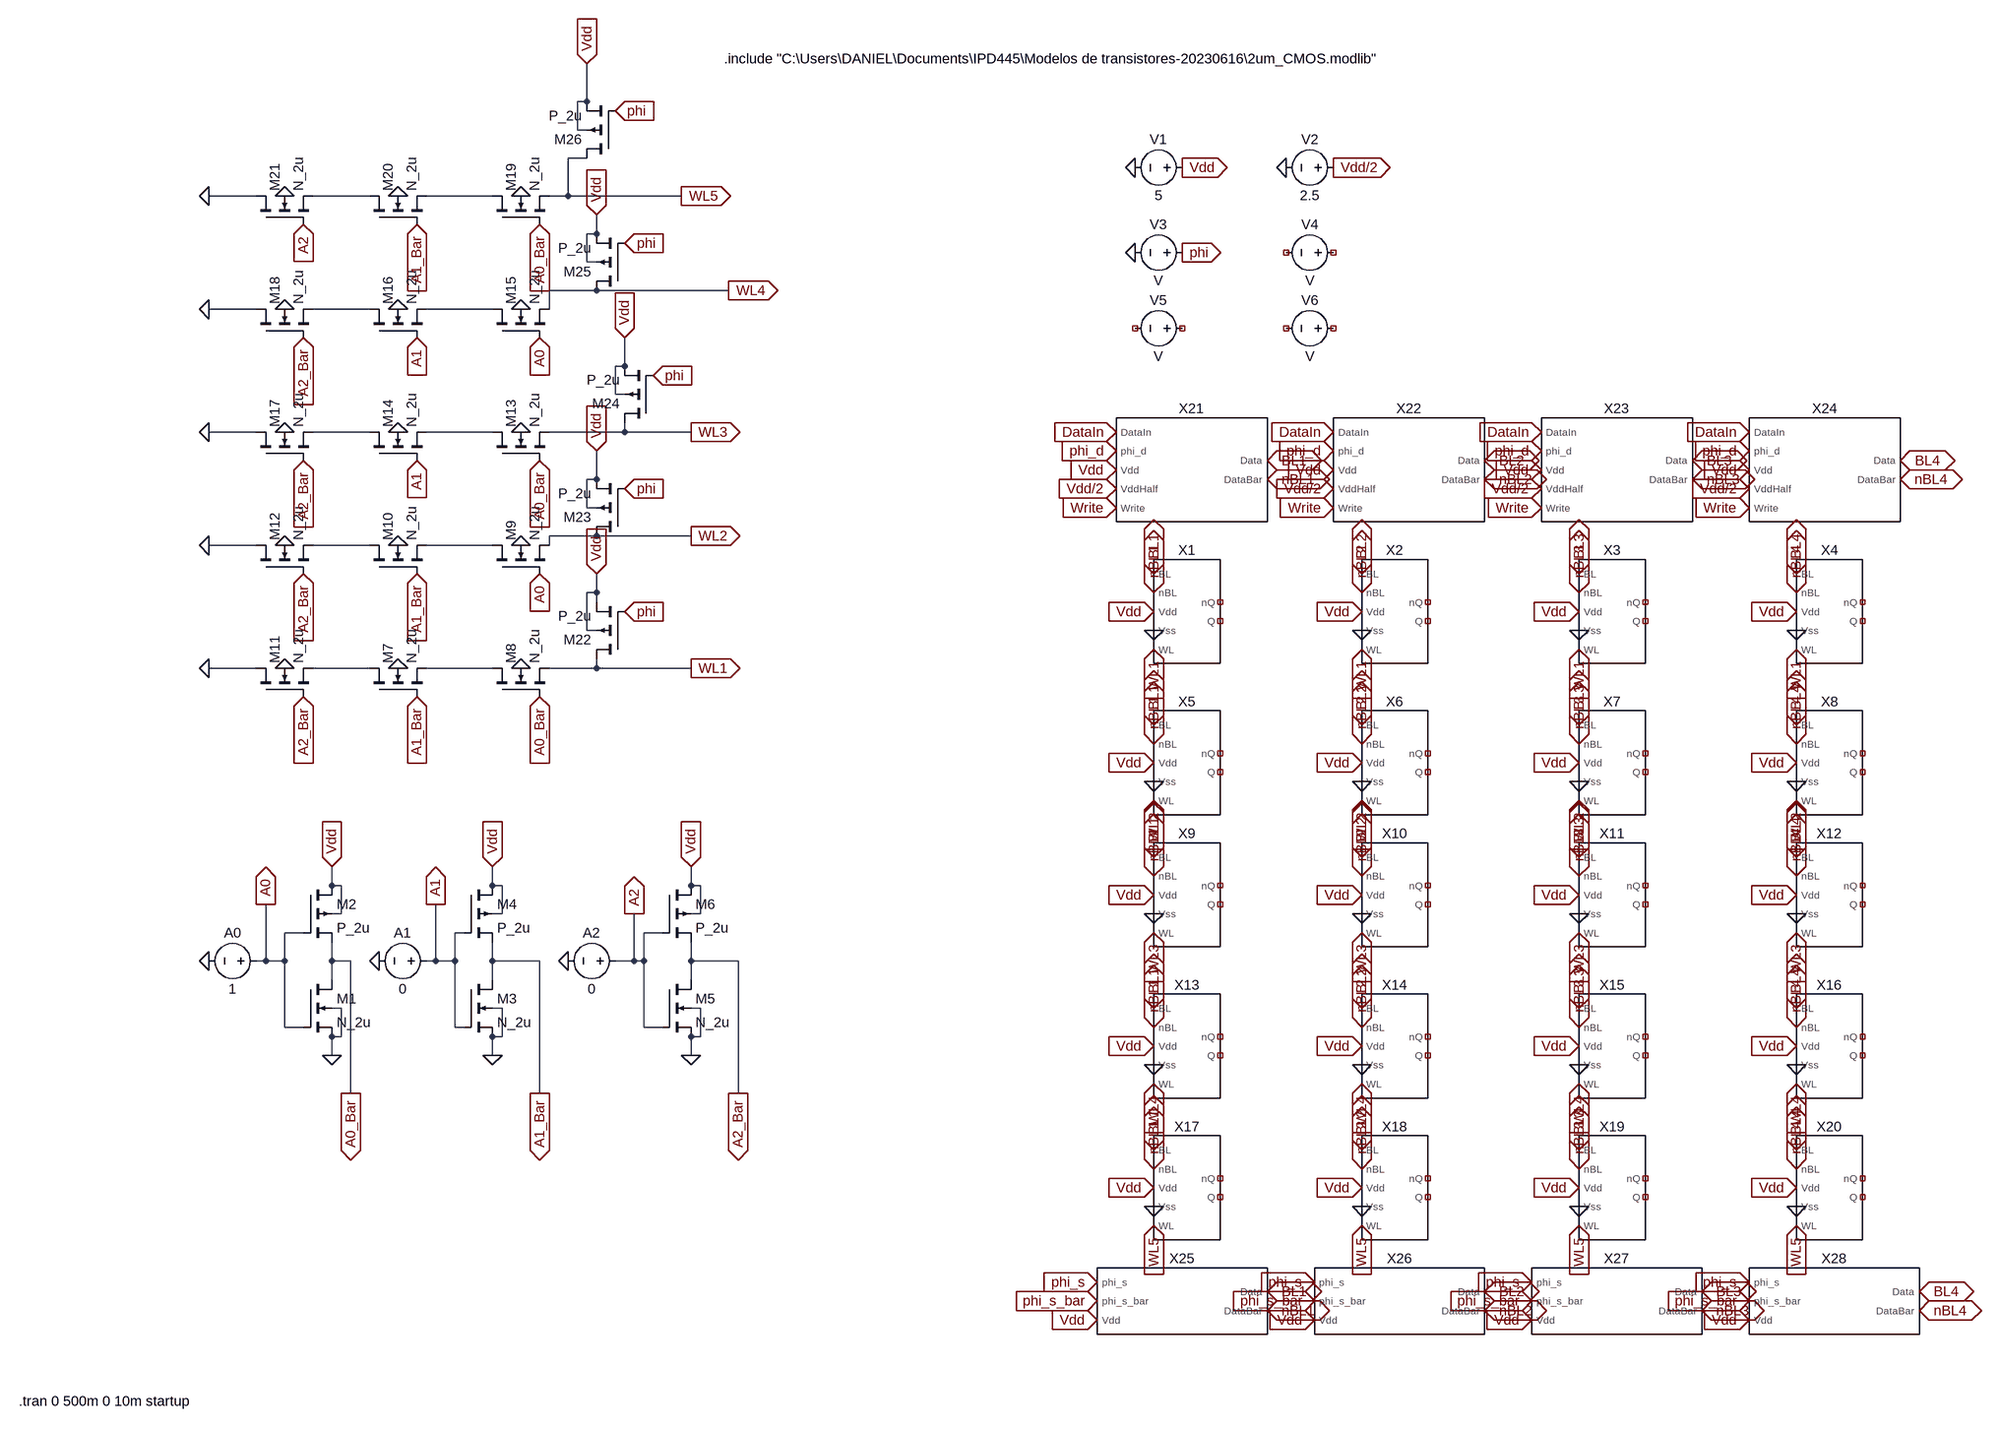
[diagram p0: schematic completo.asc]
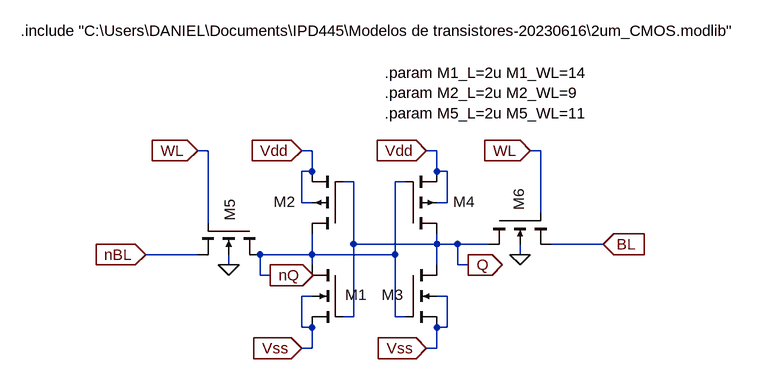
[diagram p1: sub-circuit core-final.asc]
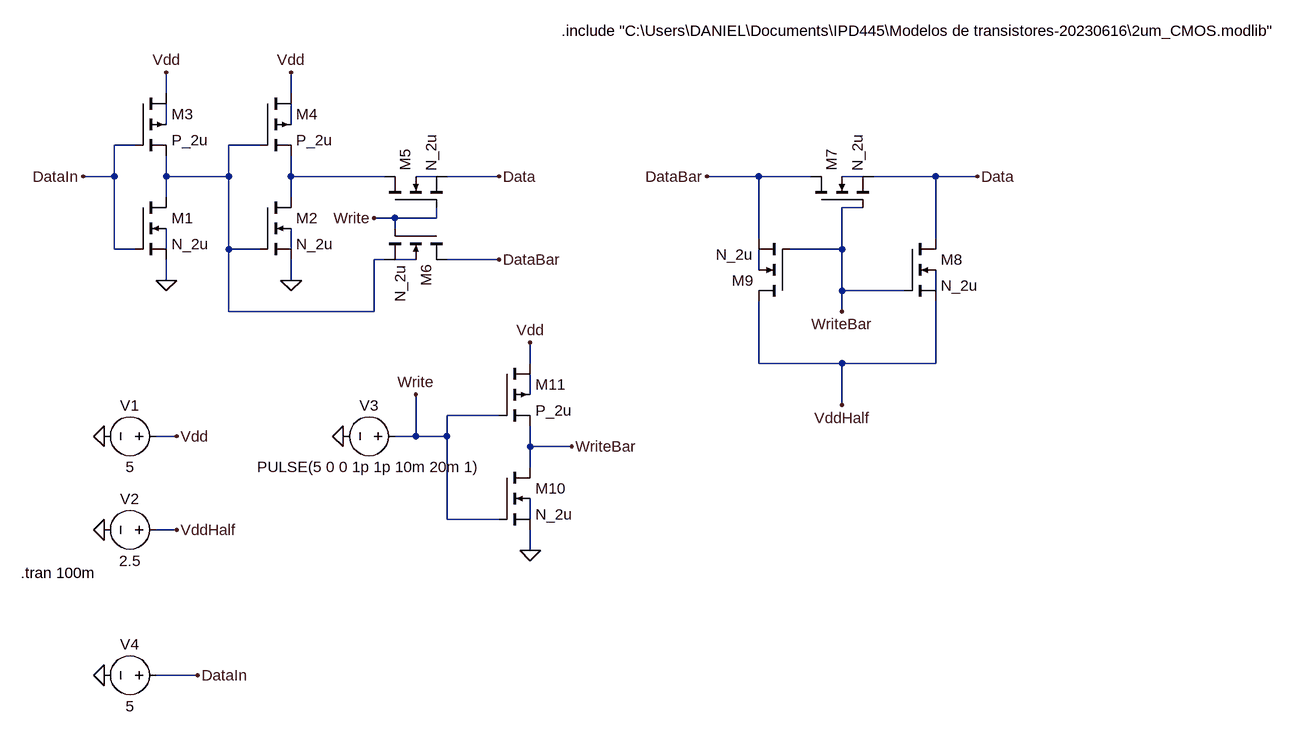
[diagram p2: sub-circuit drivers.asc]
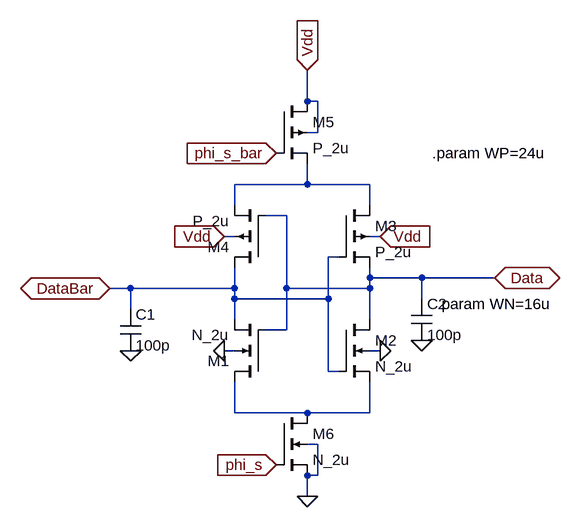
[diagram p3: sub-circuit amp.asc]
completo.asc, the LTspice schematic file:
Version 4
SHEET 1 1400 1464
WIRE -976 -832 -976 -896
WIRE -976 -832 -992 -832
WIRE -992 -784 -992 -832
WIRE -976 -784 -992 -784
WIRE -976 -736 -1008 -736
WIRE -1536 -672 -1616 -672
WIRE -1344 -672 -1440 -672
WIRE -1136 -672 -1248 -672
WIRE -1008 -672 -1008 -736
WIRE -1008 -672 -1040 -672
WIRE -816 -672 -1008 -672
WIRE -960 -608 -960 -640
WIRE -960 -608 -976 -608
WIRE -976 -560 -976 -608
WIRE -960 -560 -976 -560
WIRE -960 -512 -1040 -512
WIRE -736 -512 -960 -512
WIRE -1536 -480 -1616 -480
WIRE -1344 -480 -1440 -480
WIRE -1136 -480 -1248 -480
WIRE -1040 -480 -1040 -512
WIRE -912 -384 -912 -432
WIRE -912 -384 -928 -384
WIRE -928 -336 -928 -384
WIRE -912 -336 -928 -336
WIRE -1536 -272 -1616 -272
WIRE -1344 -272 -1440 -272
WIRE -1136 -272 -1248 -272
WIRE -912 -272 -912 -288
WIRE -912 -272 -1040 -272
WIRE -800 -272 -912 -272
WIRE -960 -192 -960 -240
WIRE -960 -192 -976 -192
WIRE -976 -144 -976 -192
WIRE -960 -144 -976 -144
WIRE -960 -96 -1040 -96
WIRE -800 -96 -960 -96
WIRE -1536 -80 -1616 -80
WIRE -1344 -80 -1440 -80
WIRE -1136 -80 -1248 -80
WIRE -1040 -80 -1040 -96
WIRE -960 0 -960 -32
WIRE -960 0 -976 0
WIRE -960 16 -960 0
WIRE -976 64 -976 0
WIRE -960 64 -976 64
WIRE -1536 128 -1616 128
WIRE -1344 128 -1440 128
WIRE -1136 128 -1248 128
WIRE -960 128 -960 112
WIRE -960 128 -1040 128
WIRE -800 128 -960 128
WIRE -1408 496 -1408 464
WIRE -1392 496 -1408 496
WIRE -1136 496 -1136 464
WIRE -1120 496 -1136 496
WIRE -800 496 -800 464
WIRE -784 496 -800 496
WIRE -1392 544 -1392 496
WIRE -1392 544 -1408 544
WIRE -1120 544 -1120 496
WIRE -1120 544 -1136 544
WIRE -784 544 -784 496
WIRE -784 544 -800 544
WIRE -1456 576 -1488 576
WIRE -1184 576 -1200 576
WIRE -848 576 -880 576
WIRE -1520 624 -1520 528
WIRE -1520 624 -1536 624
WIRE -1488 624 -1488 576
WIRE -1488 624 -1520 624
WIRE -1408 624 -1408 592
WIRE -1376 624 -1408 624
WIRE -1232 624 -1232 528
WIRE -1232 624 -1248 624
WIRE -1200 624 -1200 576
WIRE -1200 624 -1232 624
WIRE -1136 624 -1136 592
WIRE -1056 624 -1136 624
WIRE -896 624 -896 544
WIRE -896 624 -928 624
WIRE -880 624 -880 576
WIRE -880 624 -896 624
WIRE -800 624 -800 592
WIRE -720 624 -800 624
WIRE -1408 656 -1408 624
WIRE -1136 656 -1136 624
WIRE -800 656 -800 624
WIRE -1392 704 -1408 704
WIRE -1120 704 -1136 704
WIRE -784 704 -800 704
WIRE -1488 736 -1488 624
WIRE -1456 736 -1488 736
WIRE -1200 736 -1200 624
WIRE -1184 736 -1200 736
WIRE -880 736 -880 624
WIRE -848 736 -880 736
WIRE -1392 752 -1392 704
WIRE -1392 752 -1408 752
WIRE -1120 752 -1120 704
WIRE -1120 752 -1136 752
WIRE -784 752 -784 704
WIRE -784 752 -800 752
WIRE -1408 784 -1408 752
WIRE -1136 784 -1136 752
WIRE -800 784 -800 752
WIRE -1376 848 -1376 624
WIRE -1056 848 -1056 624
WIRE -720 848 -720 624
FLAG -16 96 WL1
IOPIN -16 96 In
FLAG 336 96 WL1
IOPIN 336 96 In
FLAG 704 96 WL1
IOPIN 704 96 In
FLAG 1072 96 WL1
IOPIN 1072 96 In
FLAG -16 352 WL2
IOPIN -16 352 In
FLAG 336 352 WL2
IOPIN 336 352 In
FLAG 704 352 WL2
IOPIN 704 352 In
FLAG 1072 352 WL2
IOPIN 1072 352 In
FLAG -16 576 WL3
IOPIN -16 576 In
FLAG 336 576 WL3
IOPIN 336 576 In
FLAG 704 576 WL3
IOPIN 704 576 In
FLAG 1072 576 WL3
IOPIN 1072 576 In
FLAG -16 832 WL4
IOPIN -16 832 In
FLAG 336 832 WL4
IOPIN 336 832 In
FLAG 704 832 WL4
IOPIN 704 832 In
FLAG 1072 832 WL4
IOPIN 1072 832 In
FLAG -16 1072 WL5
IOPIN -16 1072 In
FLAG 336 1072 WL5
IOPIN 336 1072 In
FLAG 704 1072 WL5
IOPIN 704 1072 In
FLAG 1072 1072 WL5
IOPIN 1072 1072 In
FLAG -16 -32 BL1
IOPIN -16 -32 BiDir
FLAG -16 224 BL1
IOPIN -16 224 BiDir
FLAG -16 448 BL1
IOPIN -16 448 BiDir
FLAG -16 704 BL1
IOPIN -16 704 BiDir
FLAG -16 944 BL1
IOPIN -16 944 BiDir
FLAG 336 -32 BL2
IOPIN 336 -32 BiDir
FLAG 336 224 BL2
IOPIN 336 224 BiDir
FLAG 336 448 BL2
IOPIN 336 448 BiDir
FLAG 336 704 BL2
IOPIN 336 704 BiDir
FLAG 336 944 BL2
IOPIN 336 944 BiDir
FLAG 704 -32 BL3
IOPIN 704 -32 BiDir
FLAG 704 224 BL3
IOPIN 704 224 BiDir
FLAG 704 448 BL3
IOPIN 704 448 BiDir
FLAG 704 704 BL3
IOPIN 704 704 BiDir
FLAG 704 944 BL3
IOPIN 704 944 BiDir
FLAG 1072 -32 BL4
IOPIN 1072 -32 BiDir
FLAG 1072 224 BL4
IOPIN 1072 224 BiDir
FLAG 1072 448 BL4
IOPIN 1072 448 BiDir
FLAG 1072 704 BL4
IOPIN 1072 704 BiDir
FLAG 1072 944 BL4
IOPIN 1072 944 BiDir
FLAG 896 -224 BL3
IOPIN 896 -224 BiDir
FLAG 1248 -224 BL4
IOPIN 1248 -224 BiDir
FLAG 544 -224 BL2
IOPIN 544 -224 BiDir
FLAG 176 -224 BL1
IOPIN 176 -224 BiDir
FLAG 176 1184 BL1
IOPIN 176 1184 BiDir
FLAG 544 1184 BL2
IOPIN 544 1184 BiDir
FLAG 912 1184 BL3
IOPIN 912 1184 BiDir
FLAG 1280 1184 BL4
IOPIN 1280 1184 BiDir
FLAG -112 1232 Vdd
IOPIN -112 1232 In
FLAG 256 1232 Vdd
IOPIN 256 1232 In
FLAG 624 1232 Vdd
IOPIN 624 1232 In
FLAG 992 1232 Vdd
IOPIN 992 1232 In
FLAG -80 -208 Vdd
IOPIN -80 -208 In
FLAG 288 -208 Vdd
IOPIN 288 -208 In
FLAG 640 -208 Vdd
IOPIN 640 -208 In
FLAG 992 -208 Vdd
IOPIN 992 -208 In
FLAG 176 -192 nBL1
IOPIN 176 -192 BiDir
FLAG -16 0 nBL1
IOPIN -16 0 BiDir
FLAG -16 256 nBL1
IOPIN -16 256 BiDir
FLAG -16 480 nBL1
IOPIN -16 480 BiDir
FLAG -16 736 nBL1
IOPIN -16 736 BiDir
FLAG -16 976 nBL1
IOPIN -16 976 BiDir
FLAG 544 -192 nBL2
IOPIN 544 -192 BiDir
FLAG 336 0 nBL2
IOPIN 336 0 BiDir
FLAG 336 256 nBL2
IOPIN 336 256 BiDir
FLAG 336 480 nBL2
IOPIN 336 480 BiDir
FLAG 336 736 nBL2
IOPIN 336 736 BiDir
FLAG 336 976 nBL2
IOPIN 336 976 BiDir
FLAG 544 1216 nBL2
IOPIN 544 1216 BiDir
FLAG 176 1216 nBL1
IOPIN 176 1216 BiDir
FLAG 896 -192 nBL3
IOPIN 896 -192 BiDir
FLAG 704 0 nBL3
IOPIN 704 0 BiDir
FLAG 704 256 nBL3
IOPIN 704 256 BiDir
FLAG 704 480 nBL3
IOPIN 704 480 BiDir
FLAG 704 736 nBL3
IOPIN 704 736 BiDir
FLAG 704 976 nBL3
IOPIN 704 976 BiDir
FLAG 912 1216 nBL3
IOPIN 912 1216 BiDir
FLAG 1248 -192 nBL4
IOPIN 1248 -192 BiDir
FLAG 1072 0 nBL4
IOPIN 1072 0 BiDir
FLAG 1072 256 nBL4
IOPIN 1072 256 BiDir
FLAG 1072 480 nBL4
IOPIN 1072 480 BiDir
FLAG 1072 736 nBL4
IOPIN 1072 736 BiDir
FLAG 1072 976 nBL4
IOPIN 1072 976 BiDir
FLAG 1280 1216 nBL4
IOPIN 1280 1216 BiDir
FLAG -16 1008 Vdd
IOPIN -16 1008 In
FLAG -16 768 Vdd
IOPIN -16 768 In
FLAG -16 512 Vdd
IOPIN -16 512 In
FLAG -16 288 Vdd
IOPIN -16 288 In
FLAG -16 32 Vdd
IOPIN -16 32 In
FLAG 336 32 Vdd
IOPIN 336 32 In
FLAG 704 32 Vdd
IOPIN 704 32 In
FLAG 1072 32 Vdd
IOPIN 1072 32 In
FLAG 1072 288 Vdd
IOPIN 1072 288 In
FLAG 1072 512 Vdd
IOPIN 1072 512 In
FLAG 1072 768 Vdd
IOPIN 1072 768 In
FLAG 1072 1008 Vdd
IOPIN 1072 1008 In
FLAG 704 1008 Vdd
IOPIN 704 1008 In
FLAG 336 1008 Vdd
IOPIN 336 1008 In
FLAG 336 768 Vdd
IOPIN 336 768 In
FLAG 704 768 Vdd
IOPIN 704 768 In
FLAG 704 512 Vdd
IOPIN 704 512 In
FLAG 336 512 Vdd
IOPIN 336 512 In
FLAG 336 288 Vdd
IOPIN 336 288 In
FLAG 704 288 Vdd
IOPIN 704 288 In
FLAG -16 64 0
FLAG 336 64 0
FLAG 704 64 0
FLAG 1072 64 0
FLAG 1072 320 0
FLAG 704 320 0
FLAG 336 320 0
FLAG -16 320 0
FLAG -16 544 0
FLAG 336 544 0
FLAG 704 544 0
FLAG 1072 544 0
FLAG 1072 800 0
FLAG 704 800 0
FLAG 336 800 0
FLAG -16 800 0
FLAG -16 1040 0
FLAG 336 1040 0
FLAG 704 1040 0
FLAG 1072 1040 0
FLAG -1408 784 0
FLAG -1408 464 Vdd
IOPIN -1408 464 In
FLAG -1136 784 0
FLAG -1136 464 Vdd
IOPIN -1136 464 In
FLAG -800 784 0
FLAG -800 464 Vdd
IOPIN -800 464 In
FLAG -1616 624 0
FLAG -1008 624 0
FLAG -1328 624 0
FLAG -1520 528 A0
IOPIN -1520 528 Out
FLAG -1232 528 A1
IOPIN -1232 528 Out
FLAG -896 544 A2
IOPIN -896 544 Out
FLAG -1376 848 A0_Bar
IOPIN -1376 848 Out
FLAG -1056 848 A1_Bar
IOPIN -1056 848 Out
FLAG -720 848 A2_Bar
IOPIN -720 848 Out
FLAG -1616 -672 0
FLAG -1616 -480 0
FLAG -1616 -272 0
FLAG -1616 -80 0
FLAG -1616 128 0
FLAG -1056 176 A0_Bar
IOPIN -1056 176 In
FLAG -1056 -224 A0_Bar
IOPIN -1056 -224 In
FLAG -1056 -624 A0_Bar
IOPIN -1056 -624 In
FLAG -1056 -32 A0
IOPIN -1056 -32 In
FLAG -1056 -432 A0
IOPIN -1056 -432 In
FLAG -1264 176 A1_Bar
IOPIN -1264 176 In
FLAG -1264 -32 A1_Bar
IOPIN -1264 -32 In
FLAG -1264 -624 A1_Bar
IOPIN -1264 -624 In
FLAG -1264 -224 A1
IOPIN -1264 -224 In
FLAG -1264 -432 A1
IOPIN -1264 -432 In
FLAG -1456 -624 A2
IOPIN -1456 -624 In
FLAG -1488 -672 0
FLAG -1296 -672 0
FLAG -1088 -672 0
FLAG -1088 -480 0
FLAG -1296 -480 0
FLAG -1488 -480 0
FLAG -1488 -272 0
FLAG -1296 -272 0
FLAG -1088 -272 0
FLAG -1088 -80 0
FLAG -1296 -80 0
FLAG -1488 -80 0
FLAG -1488 128 0
FLAG -1296 128 0
FLAG -1088 128 0
FLAG -1456 -432 A2_Bar
IOPIN -1456 -432 In
FLAG -1456 -224 A2_Bar
IOPIN -1456 -224 In
FLAG -1456 -32 A2_Bar
IOPIN -1456 -32 In
FLAG -1456 176 A2_Bar
IOPIN -1456 176 In
FLAG -976 -896 Vdd
IOPIN -976 -896 In
FLAG -960 -640 Vdd
IOPIN -960 -640 In
FLAG -912 -432 Vdd
IOPIN -912 -432 In
FLAG -960 -240 Vdd
IOPIN -960 -240 In
FLAG -960 -32 Vdd
IOPIN -960 -32 In
FLAG -928 -816 phi
IOPIN -928 -816 In
FLAG -912 -592 phi
IOPIN -912 -592 In
FLAG -864 -368 phi
IOPIN -864 -368 In
FLAG -912 -176 phi
IOPIN -912 -176 In
FLAG -912 32 phi
IOPIN -912 32 In
FLAG -816 -672 WL5
IOPIN -816 -672 Out
FLAG -736 -512 WL4
IOPIN -736 -512 Out
FLAG -800 -272 WL3
IOPIN -800 -272 Out
FLAG -800 -96 WL2
IOPIN -800 -96 Out
FLAG -800 128 WL1
IOPIN -800 128 Out
FLAG -48 -720 0
FLAG 208 -720 0
FLAG 32 -720 Vdd
IOPIN 32 -720 Out
FLAG 288 -720 Vdd/2
IOPIN 288 -720 Out
FLAG -80 -176 Vdd/2
IOPIN -80 -176 In
FLAG 288 -176 Vdd/2
IOPIN 288 -176 In
FLAG 640 -176 Vdd/2
IOPIN 640 -176 In
FLAG 992 -176 Vdd/2
IOPIN 992 -176 In
FLAG -112 1168 phi_s
IOPIN -112 1168 In
FLAG 256 1168 phi_s
IOPIN 256 1168 In
FLAG 624 1168 phi_s
IOPIN 624 1168 In
FLAG 992 1168 phi_s
IOPIN 992 1168 In
FLAG -80 -240 phi_d
IOPIN -80 -240 In
FLAG 288 -240 phi_d
IOPIN 288 -240 In
FLAG 640 -240 phi_d
IOPIN 640 -240 In
FLAG 992 -240 phi_d
IOPIN 992 -240 In
FLAG -112 1200 phi_s_bar
IOPIN -112 1200 In
FLAG 256 1200 phi_s_bar
IOPIN 256 1200 In
FLAG 624 1200 phi_s_bar
IOPIN 624 1200 In
FLAG 992 1200 phi_s_bar
IOPIN 992 1200 In
FLAG -80 -272 DataIn
IOPIN -80 -272 In
FLAG 288 -272 DataIn
IOPIN 288 -272 In
FLAG 640 -272 DataIn
IOPIN 640 -272 In
FLAG 992 -272 DataIn
IOPIN 992 -272 In
FLAG -80 -144 Write
IOPIN -80 -144 In
FLAG 288 -144 Write
IOPIN 288 -144 In
FLAG 640 -144 Write
IOPIN 640 -144 In
FLAG 992 -144 Write
IOPIN 992 -144 In
FLAG 32 -576 phi
IOPIN 32 -576 Out
FLAG -48 -576 0
SYMBOL core-final 32 32 R0
SYMATTR InstName X1
SYMBOL core-final 384 32 R0
SYMATTR InstName X2
SYMBOL core-final 752 32 R0
SYMATTR InstName X3
SYMBOL core-final 1120 32 R0
SYMATTR InstName X4
SYMBOL core-final 32 288 R0
SYMATTR InstName X5
SYMBOL core-final 384 288 R0
SYMATTR InstName X6
SYMBOL core-final 752 288 R0
SYMATTR InstName X7
SYMBOL core-final 1120 288 R0
SYMATTR InstName X8
SYMBOL core-final 32 512 R0
SYMATTR InstName X9
SYMBOL core-final 384 512 R0
SYMATTR InstName X10
SYMBOL core-final 752 512 R0
SYMATTR InstName X11
SYMBOL core-final 1120 512 R0
SYMATTR InstName X12
SYMBOL core-final 32 768 R0
SYMATTR InstName X13
SYMBOL core-final 384 768 R0
SYMATTR InstName X14
SYMBOL core-final 752 768 R0
SYMATTR InstName X15
SYMBOL core-final 1120 768 R0
SYMATTR InstName X16
SYMBOL core-final 32 1008 R0
SYMATTR InstName X17
SYMBOL core-final 384 1008 R0
SYMATTR InstName X18
SYMBOL core-final 752 1008 R0
SYMATTR InstName X19
SYMBOL core-final 1120 1008 R0
SYMATTR InstName X20
SYMBOL Drivers 48 -208 R0
SYMATTR InstName X21
SYMBOL Drivers 416 -208 R0
SYMATTR InstName X22
SYMBOL Drivers 768 -208 R0
SYMATTR InstName X23
SYMBOL Drivers 1120 -208 R0
SYMATTR InstName X24
SYMBOL amp 32 1200 R0
SYMATTR InstName X25
SYMBOL amp 400 1200 R0
SYMATTR InstName X26
SYMBOL amp 768 1200 R0
SYMATTR InstName X27
SYMBOL amp 1136 1200 R0
SYMATTR InstName X28
SYMBOL nmos4 -1456 656 R0
SYMATTR InstName M1
SYMATTR Value N_2u
SYMATTR Value2 l=2u w=8u
SYMBOL pmos4 -1456 496 R0
SYMATTR InstName M2
SYMATTR Value P_2u
SYMATTR Value2 l=2u w=12u
SYMBOL nmos4 -1184 656 R0
SYMATTR InstName M3
SYMATTR Value N_2u
SYMATTR Value2 l=2u w=8u
SYMBOL pmos4 -1184 496 R0
SYMATTR InstName M4
SYMATTR Value P_2u
SYMATTR Value2 l=2u w=12u
SYMBOL voltage -1520 624 R90
WINDOW 0 -32 56 VBottom 2
WINDOW 3 32 56 VTop 2
WINDOW 123 0 0 Left 0
WINDOW 39 0 0 Left 0
SYMATTR InstName A0
SYMATTR Value 1
SYMBOL voltage -1232 624 R90
WINDOW 0 -32 56 VBottom 2
WINDOW 3 32 56 VTop 2
WINDOW 123 0 0 Left 0
WINDOW 39 0 0 Left 0
SYMATTR InstName A1
SYMATTR Value 0
SYMBOL voltage -912 624 R90
WINDOW 0 -32 56 VBottom 2
WINDOW 3 32 56 VTop 2
WINDOW 123 0 0 Left 0
WINDOW 39 0 0 Left 0
SYMATTR InstName A2
SYMATTR Value 0
SYMBOL nmos4 -848 656 R0
SYMATTR InstName M5
SYMATTR Value N_2u
SYMATTR Value2 l=2u w=8u
SYMBOL pmos4 -848 496 R0
SYMATTR InstName M6
SYMATTR Value P_2u
SYMATTR Value2 l=2u w=12u
SYMBOL nmos4 -1136 176 R270
SYMATTR InstName M8
SYMATTR Value N_2u
SYMATTR Value2 l=2u w=8u
SYMBOL nmos4 -1344 176 R270
SYMATTR InstName M7
SYMATTR Value N_2u
SYMATTR Value2 l=2u w=8u
SYMBOL nmos4 -1136 -32 R270
SYMATTR InstName M9
SYMATTR Value N_2u
SYMATTR Value2 l=2u w=8u
SYMBOL nmos4 -1344 -32 R270
SYMATTR InstName M10
SYMATTR Value N_2u
SYMATTR Value2 l=2u w=8u
SYMBOL nmos4 -1536 176 R270
SYMATTR InstName M11
SYMATTR Value N_2u
SYMATTR Value2 l=2u w=8u
SYMBOL nmos4 -1536 -32 R270
SYMATTR InstName M12
SYMATTR Value N_2u
SYMATTR Value2 l=2u w=8u
SYMBOL nmos4 -1136 -224 R270
SYMATTR InstName M13
SYMATTR Value N_2u
SYMATTR Value2 l=2u w=8u
SYMBOL nmos4 -1344 -224 R270
SYMATTR InstName M14
SYMATTR Value N_2u
SYMATTR Value2 l=2u w=8u
SYMBOL nmos4 -1136 -432 R270
SYMATTR InstName M15
SYMATTR Value N_2u
SYMATTR Value2 l=2u w=8u
SYMBOL nmos4 -1344 -432 R270
SYMATTR InstName M16
SYMATTR Value N_2u
SYMATTR Value2 l=2u w=8u
SYMBOL nmos4 -1536 -224 R270
SYMATTR InstName M17
SYMATTR Value N_2u
SYMATTR Value2 l=2u w=8u
SYMBOL nmos4 -1536 -432 R270
SYMATTR InstName M18
SYMATTR Value N_2u
SYMATTR Value2 l=2u w=8u
SYMBOL nmos4 -1136 -624 R270
SYMATTR InstName M19
SYMATTR Value N_2u
SYMATTR Value2 l=2u w=8u
SYMBOL nmos4 -1344 -624 R270
SYMATTR InstName M20
SYMATTR Value N_2u
SYMATTR Value2 l=2u w=8u
SYMBOL nmos4 -1536 -624 R270
SYMATTR InstName M21
SYMATTR Value N_2u
SYMATTR Value2 l=2u w=8u
SYMBOL pmos4 -912 112 R180
SYMATTR InstName M22
SYMATTR Value P_2u
SYMATTR Value2 l=2u w=12u
SYMBOL pmos4 -912 -96 R180
SYMATTR InstName M23
SYMATTR Value P_2u
SYMATTR Value2 l=2u w=12u
SYMBOL pmos4 -864 -288 R180
SYMATTR InstName M24
SYMATTR Value P_2u
SYMATTR Value2 l=2u w=12u
SYMBOL pmos4 -912 -512 R180
SYMATTR InstName M25
SYMATTR Value P_2u
SYMATTR Value2 l=2u w=8u
SYMBOL pmos4 -928 -736 R180
SYMATTR InstName M26
SYMATTR Value P_2u
SYMATTR Value2 l=2u w=12u
SYMBOL voltage 48 -720 R90
WINDOW 0 -32 56 VBottom 2
WINDOW 3 32 56 VTop 2
WINDOW 123 0 0 Left 0
WINDOW 39 0 0 Left 0
SYMATTR InstName V1
SYMATTR Value 5
SYMBOL voltage 304 -720 R90
WINDOW 0 -32 56 VBottom 2
WINDOW 3 32 56 VTop 2
WINDOW 123 0 0 Left 0
WINDOW 39 0 0 Left 0
SYMATTR InstName V2
SYMATTR Value 2.5
SYMBOL voltage 48 -576 R90
WINDOW 0 -32 56 VBottom 2
WINDOW 3 32 56 VTop 2
SYMATTR InstName V3
SYMBOL voltage 304 -576 R90
WINDOW 0 -32 56 VBottom 2
WINDOW 3 32 56 VTop 2
SYMATTR InstName V4
SYMBOL voltage 48 -448 R90
WINDOW 0 -32 56 VBottom 2
WINDOW 3 32 56 VTop 2
SYMATTR InstName V5
SYMBOL voltage 304 -448 R90
WINDOW 0 -32 56 VBottom 2
WINDOW 3 32 56 VTop 2
SYMATTR InstName V6
TEXT -1938 1448 Left 2 !.tran 0 500m 0 10m startup
TEXT -744 -904 Left 2 !.include "C:\\Users\\DANIEL\\Documents\\IPD445\\Modelos de transistores-20230616\\2um_CMOS.modlib"

core-final.asc, the sub-circuit schematic file:
Version 4
SHEET 1 1180 1172
WIRE -560 112 -576 112
WIRE -400 112 -416 112
WIRE -208 112 -224 112
WIRE -48 112 -64 112
WIRE -400 144 -400 112
WIRE -400 144 -416 144
WIRE -208 144 -208 112
WIRE -192 144 -208 144
WIRE -336 160 -352 160
WIRE -256 160 -272 160
WIRE -416 192 -416 144
WIRE -400 192 -416 192
WIRE -192 192 -192 144
WIRE -192 192 -208 192
WIRE -48 208 -48 112
WIRE -560 224 -560 112
WIRE -336 256 -336 160
WIRE -208 256 -208 240
WIRE -208 256 -336 256
WIRE -176 256 -208 256
WIRE -128 256 -176 256
WIRE 48 256 -32 256
WIRE -576 272 -656 272
WIRE -400 272 -400 240
WIRE -400 272 -480 272
WIRE -272 272 -272 160
WIRE -272 272 -400 272
WIRE -80 272 -80 256
WIRE -528 288 -528 272
WIRE -400 288 -400 272
WIRE -208 288 -208 256
WIRE -176 288 -176 256
WIRE -160 288 -176 288
WIRE -480 304 -480 272
WIRE -464 304 -480 304
WIRE -400 336 -416 336
WIRE -192 336 -208 336
WIRE -336 368 -336 256
WIRE -336 368 -352 368
WIRE -272 368 -272 272
WIRE -256 368 -272 368
WIRE -416 384 -416 336
WIRE -400 384 -416 384
WIRE -192 384 -192 336
WIRE -192 384 -208 384
WIRE -400 416 -400 384
WIRE -400 416 -416 416
WIRE -208 416 -208 384
WIRE -208 416 -224 416
FLAG -416 416 Vss
IOPIN -416 416 In
FLAG -656 272 nBL
IOPIN -656 272 In
FLAG 48 256 BL
IOPIN 48 256 In
FLAG -576 112 WL
IOPIN -576 112 In
FLAG -64 112 WL
IOPIN -64 112 In
FLAG -416 112 Vdd
IOPIN -416 112 In
FLAG -224 112 Vdd
IOPIN -224 112 In
FLAG -464 304 nQ
IOPIN -464 304 Out
FLAG -160 288 Q
IOPIN -160 288 Out
FLAG -224 416 Vss
IOPIN -224 416 In
FLAG -528 288 0
FLAG -80 272 0
SYMBOL pmos4 -352 240 R180
WINDOW 0 73 49 Left 2
WINDOW 3 55 45 Invisible 2
SYMATTR InstName M2
SYMATTR Value P_2u
SYMATTR Value2 l={M2_L} w={M2_L * M2_WL}
SYMBOL nmos4 -352 288 M0
WINDOW 0 -37 46 Left 2
WINDOW 3 -70 42 Invisible 2
SYMATTR InstName M1
SYMATTR Value N_2u
SYMATTR Value2 l={M1_L} w={M1_L * M1_WL}
SYMBOL pmos4 -256 240 M180
WINDOW 0 73 49 Left 2
WINDOW 3 55 45 Invisible 2
SYMATTR InstName M4
SYMATTR Value P_2u
SYMATTR Value2 l={M2_L} w={M2_L * M2_WL}
SYMBOL nmos4 -256 288 R0
WINDOW 0 -37 46 Left 2
WINDOW 3 -70 42 Invisible 2
SYMATTR InstName M3
SYMATTR Value N_2u
SYMATTR Value2 l={M1_L} w={M1_L * M1_WL}
SYMBOL nmos4 -480 224 R90
WINDOW 0 -37 46 Left 2
WINDOW 3 -70 42 Invisible 2
SYMATTR InstName M5
SYMATTR Value N_2u
SYMATTR Value2 l={M5_L} w={M5_L * M5_WL}
SYMBOL nmos4 -128 208 M90
WINDOW 0 -37 46 Left 2
WINDOW 3 -70 42 Invisible 2
SYMATTR InstName M6
SYMATTR Value N_2u
SYMATTR Value2 l={M5_L} w={M5_L * M5_WL}
TEXT -848 -72 Left 2 !.include "C:\\Users\\DANIEL\\Documents\\IPD445\\Modelos de transistores-20230616\\2um_CMOS.modlib"
TEXT -288 -8 Left 2 !.param M1_L=2u M1_WL=14\n.param M2_L=2u M2_WL=9\n.param M5_L=2u M5_WL=11

drivers.asc, the sub-circuit schematic file:
Version 4
SHEET 1 1876 976
WIRE 48 16 48 -16
WIRE 240 16 240 -16
WIRE 48 64 48 32
WIRE 240 64 240 32
WIRE 0 96 -32 96
WIRE 192 96 144 96
WIRE -32 144 -32 96
WIRE -32 144 -80 144
WIRE 48 144 48 112
WIRE 144 144 144 96
WIRE 144 144 48 144
WIRE 240 144 240 112
WIRE 384 144 240 144
WIRE 464 144 432 144
WIRE 560 144 480 144
WIRE 960 144 880 144
WIRE 1040 144 960 144
WIRE 1120 144 1088 144
WIRE 1232 144 1136 144
WIRE 1296 144 1232 144
WIRE 48 176 48 144
WIRE 240 176 240 144
WIRE 1120 192 1088 192
WIRE 400 208 368 208
WIRE 464 208 464 192
WIRE 464 208 400 208
WIRE 400 224 400 208
WIRE 960 240 960 144
WIRE 1232 240 1232 144
WIRE -32 256 -32 144
WIRE 0 256 -32 256
WIRE 48 256 48 224
WIRE 144 256 144 144
WIRE 192 256 144 256
WIRE 240 256 240 224
WIRE 1088 256 1088 192
WIRE 1088 256 1008 256
WIRE 384 272 368 272
WIRE 432 272 400 272
WIRE 560 272 480 272
WIRE 960 288 960 256
WIRE 48 304 48 272
WIRE 240 304 240 272
WIRE 1088 320 1088 256
WIRE 1184 320 1088 320
WIRE 1232 320 1232 288
WIRE 144 352 144 256
WIRE 368 352 368 272
WIRE 368 352 144 352
WIRE 1088 352 1088 320
WIRE 608 432 608 400
WIRE 960 432 960 336
WIRE 1088 432 960 432
WIRE 1232 432 1232 336
WIRE 1232 432 1088 432
WIRE 608 480 608 448
WIRE 1088 496 1088 432
WIRE 560 512 480 512
WIRE 64 544 32 544
WIRE 432 544 432 480
WIRE 432 544 400 544
WIRE 480 544 480 512
WIRE 480 544 432 544
WIRE 608 560 608 528
WIRE 672 560 608 560
WIRE 608 592 608 560
WIRE 480 672 480 544
WIRE 560 672 480 672
WIRE 608 672 608 640
WIRE 64 688 32 688
WIRE 608 720 608 688
WIRE 96 912 32 912
FLAG 48 304 0
FLAG 240 304 0
FLAG 48 -16 Vdd
FLAG 240 -16 Vdd
FLAG 368 208 Write
FLAG -80 144 DataIn
FLAG 560 144 Data
FLAG 560 272 DataBar
FLAG 1088 496 VddHalf
FLAG 1088 352 WriteBar
FLAG 880 144 DataBar
FLAG 1296 144 Data
FLAG -48 544 0
FLAG -48 688 0
FLAG 64 544 Vdd
FLAG 64 688 VddHalf
FLAG 320 544 0
FLAG 608 720 0
FLAG 608 400 Vdd
FLAG 432 480 Write
FLAG 672 560 WriteBar
FLAG -48 912 0
FLAG 96 912 DataIn
SYMBOL nmos4 0 176 R0
SYMATTR InstName M1
SYMATTR Value N_2u
SYMATTR Value2 l=2u w=8u
SYMBOL nmos4 192 176 R0
SYMATTR InstName M2
SYMATTR Value N_2u
SYMATTR Value2 l=2u w=8u
SYMBOL pmos4 0 16 R0
SYMATTR InstName M3
SYMATTR Value P_2u
SYMATTR Value2 l=2u w=12u
SYMBOL pmos4 192 16 R0
SYMATTR InstName M4
SYMATTR Value P_2u
SYMATTR Value2 l=2u w=12u
SYMBOL nmos4 384 192 R270
SYMATTR InstName M5
SYMATTR Value N_2u
SYMATTR Value2 l=2u w=8u
SYMBOL nmos4 480 224 R90
SYMATTR InstName M6
SYMATTR Value N_2u
SYMATTR Value2 l=2u w=8u
SYMBOL nmos4 1040 192 R270
SYMATTR InstName M7
SYMATTR Value N_2u
SYMATTR Value2 l=2u w=8u
SYMBOL nmos4 1184 240 R0
SYMATTR InstName M8
SYMATTR Value N_2u
SYMATTR Value2 l=2u w=8u
SYMBOL nmos4 1008 336 R180
SYMATTR InstName M9
SYMATTR Value N_2u
SYMATTR Value2 l=2u w=8u
SYMBOL voltage 48 544 R90
WINDOW 0 -32 56 VBottom 2
WINDOW 3 32 56 VTop 2
WINDOW 123 0 0 Left 0
WINDOW 39 0 0 Left 0
SYMATTR InstName V1
SYMATTR Value 5
SYMBOL voltage 48 688 R90
WINDOW 0 -32 56 VBottom 2
WINDOW 3 32 56 VTop 2
WINDOW 123 0 0 Left 0
WINDOW 39 0 0 Left 0
SYMATTR InstName V2
SYMATTR Value 2.5
SYMBOL voltage 416 544 R90
WINDOW 0 -32 56 VBottom 2
WINDOW 3 32 56 VTop 2
WINDOW 123 0 0 Left 0
WINDOW 39 0 0 Left 0
SYMATTR InstName V3
SYMATTR Value PULSE(5 0 0 1p 1p 10m 20m 1)
SYMBOL nmos4 560 592 R0
SYMATTR InstName M10
SYMATTR Value N_2u
SYMATTR Value2 l=2u w=8u
SYMBOL pmos4 560 432 R0
SYMATTR InstName M11
SYMATTR Value P_2u
SYMATTR Value2 l=2u w=12u
SYMBOL voltage 48 912 R90
WINDOW 0 -32 56 VBottom 2
WINDOW 3 32 56 VTop 2
WINDOW 123 0 0 Left 0
WINDOW 39 0 0 Left 0
SYMATTR InstName V4
SYMATTR Value 5
TEXT 656 -80 Left 2 !.include "C:\\Users\\DANIEL\\Documents\\IPD445\\Modelos de transistores-20230616\\2um_CMOS.modlib"
TEXT -176 754 Left 2 !.tran 100m

amp.asc, the sub-circuit schematic file:
Version 4
SHEET 1 880 680
WIRE 176 -144 176 -192
WIRE 192 -144 176 -144
WIRE 192 -96 192 -144
WIRE 192 -96 176 -96
WIRE 176 -16 176 -48
WIRE 176 -16 64 -16
WIRE 272 -16 176 -16
WIRE 64 16 64 -16
WIRE 272 16 272 -16
WIRE 144 32 112 32
WIRE 64 64 48 64
WIRE 288 64 272 64
WIRE 224 96 208 96
WIRE 272 128 272 112
WIRE 352 128 272 128
WIRE 464 128 352 128
WIRE -96 144 -128 144
WIRE 64 144 64 112
WIRE 64 144 -96 144
WIRE 144 144 144 32
WIRE 272 144 272 128
WIRE 272 144 144 144
WIRE 64 160 64 144
WIRE 208 160 208 96
WIRE 208 160 64 160
WIRE 352 160 352 128
WIRE -96 176 -96 144
WIRE 64 192 64 160
WIRE 272 192 272 144
WIRE 144 208 144 144
WIRE 144 208 112 208
WIRE 64 240 48 240
WIRE 288 240 272 240
WIRE 208 272 208 160
WIRE 224 272 208 272
WIRE 64 336 64 288
WIRE 176 336 64 336
WIRE 272 336 272 288
WIRE 272 336 176 336
WIRE 192 384 176 384
WIRE 192 432 192 384
WIRE 192 432 176 432
WIRE 176 464 176 432
FLAG 176 -192 Vdd
IOPIN 176 -192 In
FLAG 128 -64 phi_s_bar
IOPIN 128 -64 In
FLAG 128 416 phi_s
IOPIN 128 416 In
FLAG 176 464 0
FLAG -128 144 DataBar
IOPIN -128 144 BiDir
FLAG 464 128 Data
IOPIN 464 128 BiDir
FLAG 288 64 Vdd
IOPIN 288 64 In
FLAG 48 64 Vdd
IOPIN 48 64 In
FLAG 288 240 0
FLAG 48 240 0
FLAG -96 240 0
FLAG 352 224 0
SYMBOL nmos4 112 288 R180
SYMATTR InstName M1
SYMATTR Value N_2u
SYMATTR Value2 l=2u w={WN}
SYMBOL nmos4 224 192 R0
SYMATTR InstName M2
SYMATTR Value N_2u
SYMATTR Value2 l=2u w={WN}
SYMBOL pmos4 224 16 R0
SYMATTR InstName M3
SYMATTR Value P_2u
SYMATTR Value2 l=2u w={WP}
SYMBOL pmos4 112 112 R180
SYMATTR InstName M4
SYMATTR Value P_2u
SYMATTR Value2 l=2u w={WP}
SYMBOL pmos4 128 -144 R0
SYMATTR InstName M5
SYMATTR Value P_2u
SYMATTR Value2 l=2u w={WP}
SYMBOL nmos4 128 336 R0
SYMATTR InstName M6
SYMATTR Value N_2u
SYMATTR Value2 l=2u w={WN}
SYMBOL cap -112 176 R0
SYMATTR InstName C1
SYMATTR Value 100p
SYMBOL cap 336 160 R0
SYMATTR InstName C2
SYMATTR Value 100p
TEXT 368 -64 Left 2 !.param WP=24u
TEXT 376 168 Left 2 !.param WN=16u

The netlist it stands for:
* completo.asc
XX1 BL1 nBL1 Vdd 0 WL1 NC_01 NC_02 core-final
XX2 BL2 nBL2 Vdd 0 WL1 NC_03 NC_04 core-final
XX3 BL3 nBL3 Vdd 0 WL1 NC_05 NC_06 core-final
XX4 BL4 nBL4 Vdd 0 WL1 NC_07 NC_08 core-final
XX5 BL1 nBL1 Vdd 0 WL2 NC_09 NC_10 core-final
XX6 BL2 nBL2 Vdd 0 WL2 NC_11 NC_12 core-final
XX7 BL3 nBL3 Vdd 0 WL2 NC_13 NC_14 core-final
XX8 BL4 nBL4 Vdd 0 WL2 NC_15 NC_16 core-final
XX9 BL1 nBL1 Vdd 0 WL3 NC_17 NC_18 core-final
XX10 BL2 nBL2 Vdd 0 WL3 NC_19 NC_20 core-final
XX11 BL3 nBL3 Vdd 0 WL3 NC_21 NC_22 core-final
XX12 BL4 nBL4 Vdd 0 WL3 NC_23 NC_24 core-final
XX13 BL1 nBL1 Vdd 0 WL4 NC_25 NC_26 core-final
XX14 BL2 nBL2 Vdd 0 WL4 NC_27 NC_28 core-final
XX15 BL3 nBL3 Vdd 0 WL4 NC_29 NC_30 core-final
XX16 BL4 nBL4 Vdd 0 WL4 NC_31 NC_32 core-final
XX17 BL1 nBL1 Vdd 0 WL5 NC_33 NC_34 core-final
XX18 BL2 nBL2 Vdd 0 WL5 NC_35 NC_36 core-final
XX19 BL3 nBL3 Vdd 0 WL5 NC_37 NC_38 core-final
XX20 BL4 nBL4 Vdd 0 WL5 NC_39 NC_40 core-final
XX21 DataIn phi_d Vdd Vdd/2 Write BL1 nBL1 drivers
XX22 DataIn phi_d Vdd Vdd/2 Write BL2 nBL2 drivers
XX23 DataIn phi_d Vdd Vdd/2 Write BL3 nBL3 drivers
XX24 DataIn phi_d Vdd Vdd/2 Write BL4 nBL4 drivers
XX25 phi_s phi_s_bar Vdd BL1 nBL1 amp
XX26 phi_s phi_s_bar Vdd BL2 nBL2 amp
XX27 phi_s phi_s_bar Vdd BL3 nBL3 amp
XX28 phi_s phi_s_bar Vdd BL4 nBL4 amp
M1 A0_Bar A0 0 0 N_2u l=2u w=8u
M2 Vdd A0 A0_Bar Vdd P_2u l=2u w=12u
M3 A1_Bar A1 0 0 N_2u l=2u w=8u
M4 Vdd A1 A1_Bar Vdd P_2u l=2u w=12u
V§A0 A0 0 1
V§A1 A1 0 0
V§A2 A2 0 0
M5 A2_Bar A2 0 0 N_2u l=2u w=8u
M6 Vdd A2 A2_Bar Vdd P_2u l=2u w=12u
M8 N010 A0_Bar WL1 0 N_2u l=2u w=8u
M7 N009 A1_Bar N010 0 N_2u l=2u w=8u
M9 N008 A0 WL2 0 N_2u l=2u w=8u
M10 N007 A1_Bar N008 0 N_2u l=2u w=8u
M11 0 A2_Bar N009 0 N_2u l=2u w=8u
M12 0 A2_Bar N007 0 N_2u l=2u w=8u
M13 N006 A0_Bar WL3 0 N_2u l=2u w=8u
M14 N005 A1 N006 0 N_2u l=2u w=8u
M15 N004 A0 WL4 0 N_2u l=2u w=8u
M16 N003 A1 N004 0 N_2u l=2u w=8u
M17 0 A2_Bar N005 0 N_2u l=2u w=8u
M18 0 A2_Bar N003 0 N_2u l=2u w=8u
M19 N002 A0_Bar WL5 0 N_2u l=2u w=8u
M20 N001 A1_Bar N002 0 N_2u l=2u w=8u
M21 0 A2 N001 0 N_2u l=2u w=8u
M22 WL1 phi Vdd Vdd P_2u l=2u w=12u
M23 WL2 phi Vdd Vdd P_2u l=2u w=12u
M24 WL3 phi Vdd Vdd P_2u l=2u w=12u
M25 WL4 phi Vdd Vdd P_2u l=2u w=8u
M26 WL5 phi Vdd Vdd P_2u l=2u w=12u
V1 Vdd 0 5
V2 Vdd/2 0 2.5
V3 phi 0 V
V4 NC_41 NC_42 V
V5 NC_43 NC_44 V
V6 NC_45 NC_46 V

* block symbol definitions
.subckt core-final BL nBL Vdd Vss WL nQ Q
M2 nQ Q Vdd Vdd P_2u l={M2_L} w={M2_L * M2_WL}
M1 nQ Q Vss Vss N_2u l={M1_L} w={M1_L * M1_WL}
M4 Q nQ Vdd Vdd P_2u l={M2_L} w={M2_L * M2_WL}
M3 Q nQ Vss Vss N_2u l={M1_L} w={M1_L * M1_WL}
M5 nQ WL nBL 0 N_2u l={M5_L} w={M5_L * M5_WL}
M6 Q WL BL 0 N_2u l={M5_L} w={M5_L * M5_WL}
.include "C:\Users\DANIEL\Documents\IPD445\Modelos de transistores-20230616\2um_CMOS.modlib"
.param M1_L=2u M1_WL=14
.param M2_L=2u M2_WL=9
.param M5_L=2u M5_WL=11
.ends core-final

.subckt drivers DataIn phi_d Vdd VddHalf Write Data DataBar
M1 N003 DataIn 0 N007 N_2u l=2u w=8u
M2 N004 N003 0 N008 N_2u l=2u w=8u
M3 Vdd DataIn N003 N001 P_2u l=2u w=12u
M4 Vdd N003 N004 N002 P_2u l=2u w=12u
M5 N004 Write Data N005 N_2u l=2u w=8u
M6 DataBar Write N003 N009 N_2u l=2u w=8u
M7 DataBar WriteBar Data N006 N_2u l=2u w=8u
M8 Data WriteBar VddHalf N011 N_2u l=2u w=8u
M9 VddHalf WriteBar DataBar N010 N_2u l=2u w=8u
V1 Vdd 0 5
V2 VddHalf 0 2.5
V3 Write 0 PULSE(5 0 0 1p 1p 10m 20m 1)
M10 WriteBar Write 0 N013 N_2u l=2u w=8u
M11 Vdd Write WriteBar N012 P_2u l=2u w=12u
V4 DataIn 0 5
.include "C:\Users\DANIEL\Documents\IPD445\Modelos de transistores-20230616\2um_CMOS.modlib"
.tran 100m
.ends drivers

.subckt amp phi_s phi_s_bar Vdd Data DataBar
M1 N002 Data DataBar 0 N_2u l=2u w={WN}
M2 Data DataBar N002 0 N_2u l=2u w={WN}
M3 N001 DataBar Data Vdd P_2u l=2u w={WP}
M4 DataBar Data N001 Vdd P_2u l=2u w={WP}
M5 Vdd phi_s_bar N001 Vdd P_2u l=2u w={WP}
M6 N002 phi_s 0 0 N_2u l=2u w={WN}
C1 DataBar 0 100p
C2 Data 0 100p
.param WP=24u
.param WN=16u
.ends amp

.model NMOS NMOS
.model PMOS PMOS
.lib standard.mos
.tran 0 500m 0 10m startup
.include "C:\Users\DANIEL\Documents\IPD445\Modelos de transistores-20230616\2um_CMOS.modlib"
.backanno
.end